# Altium schematic sheet Henishbhai.SchDoc
size OrCAD D
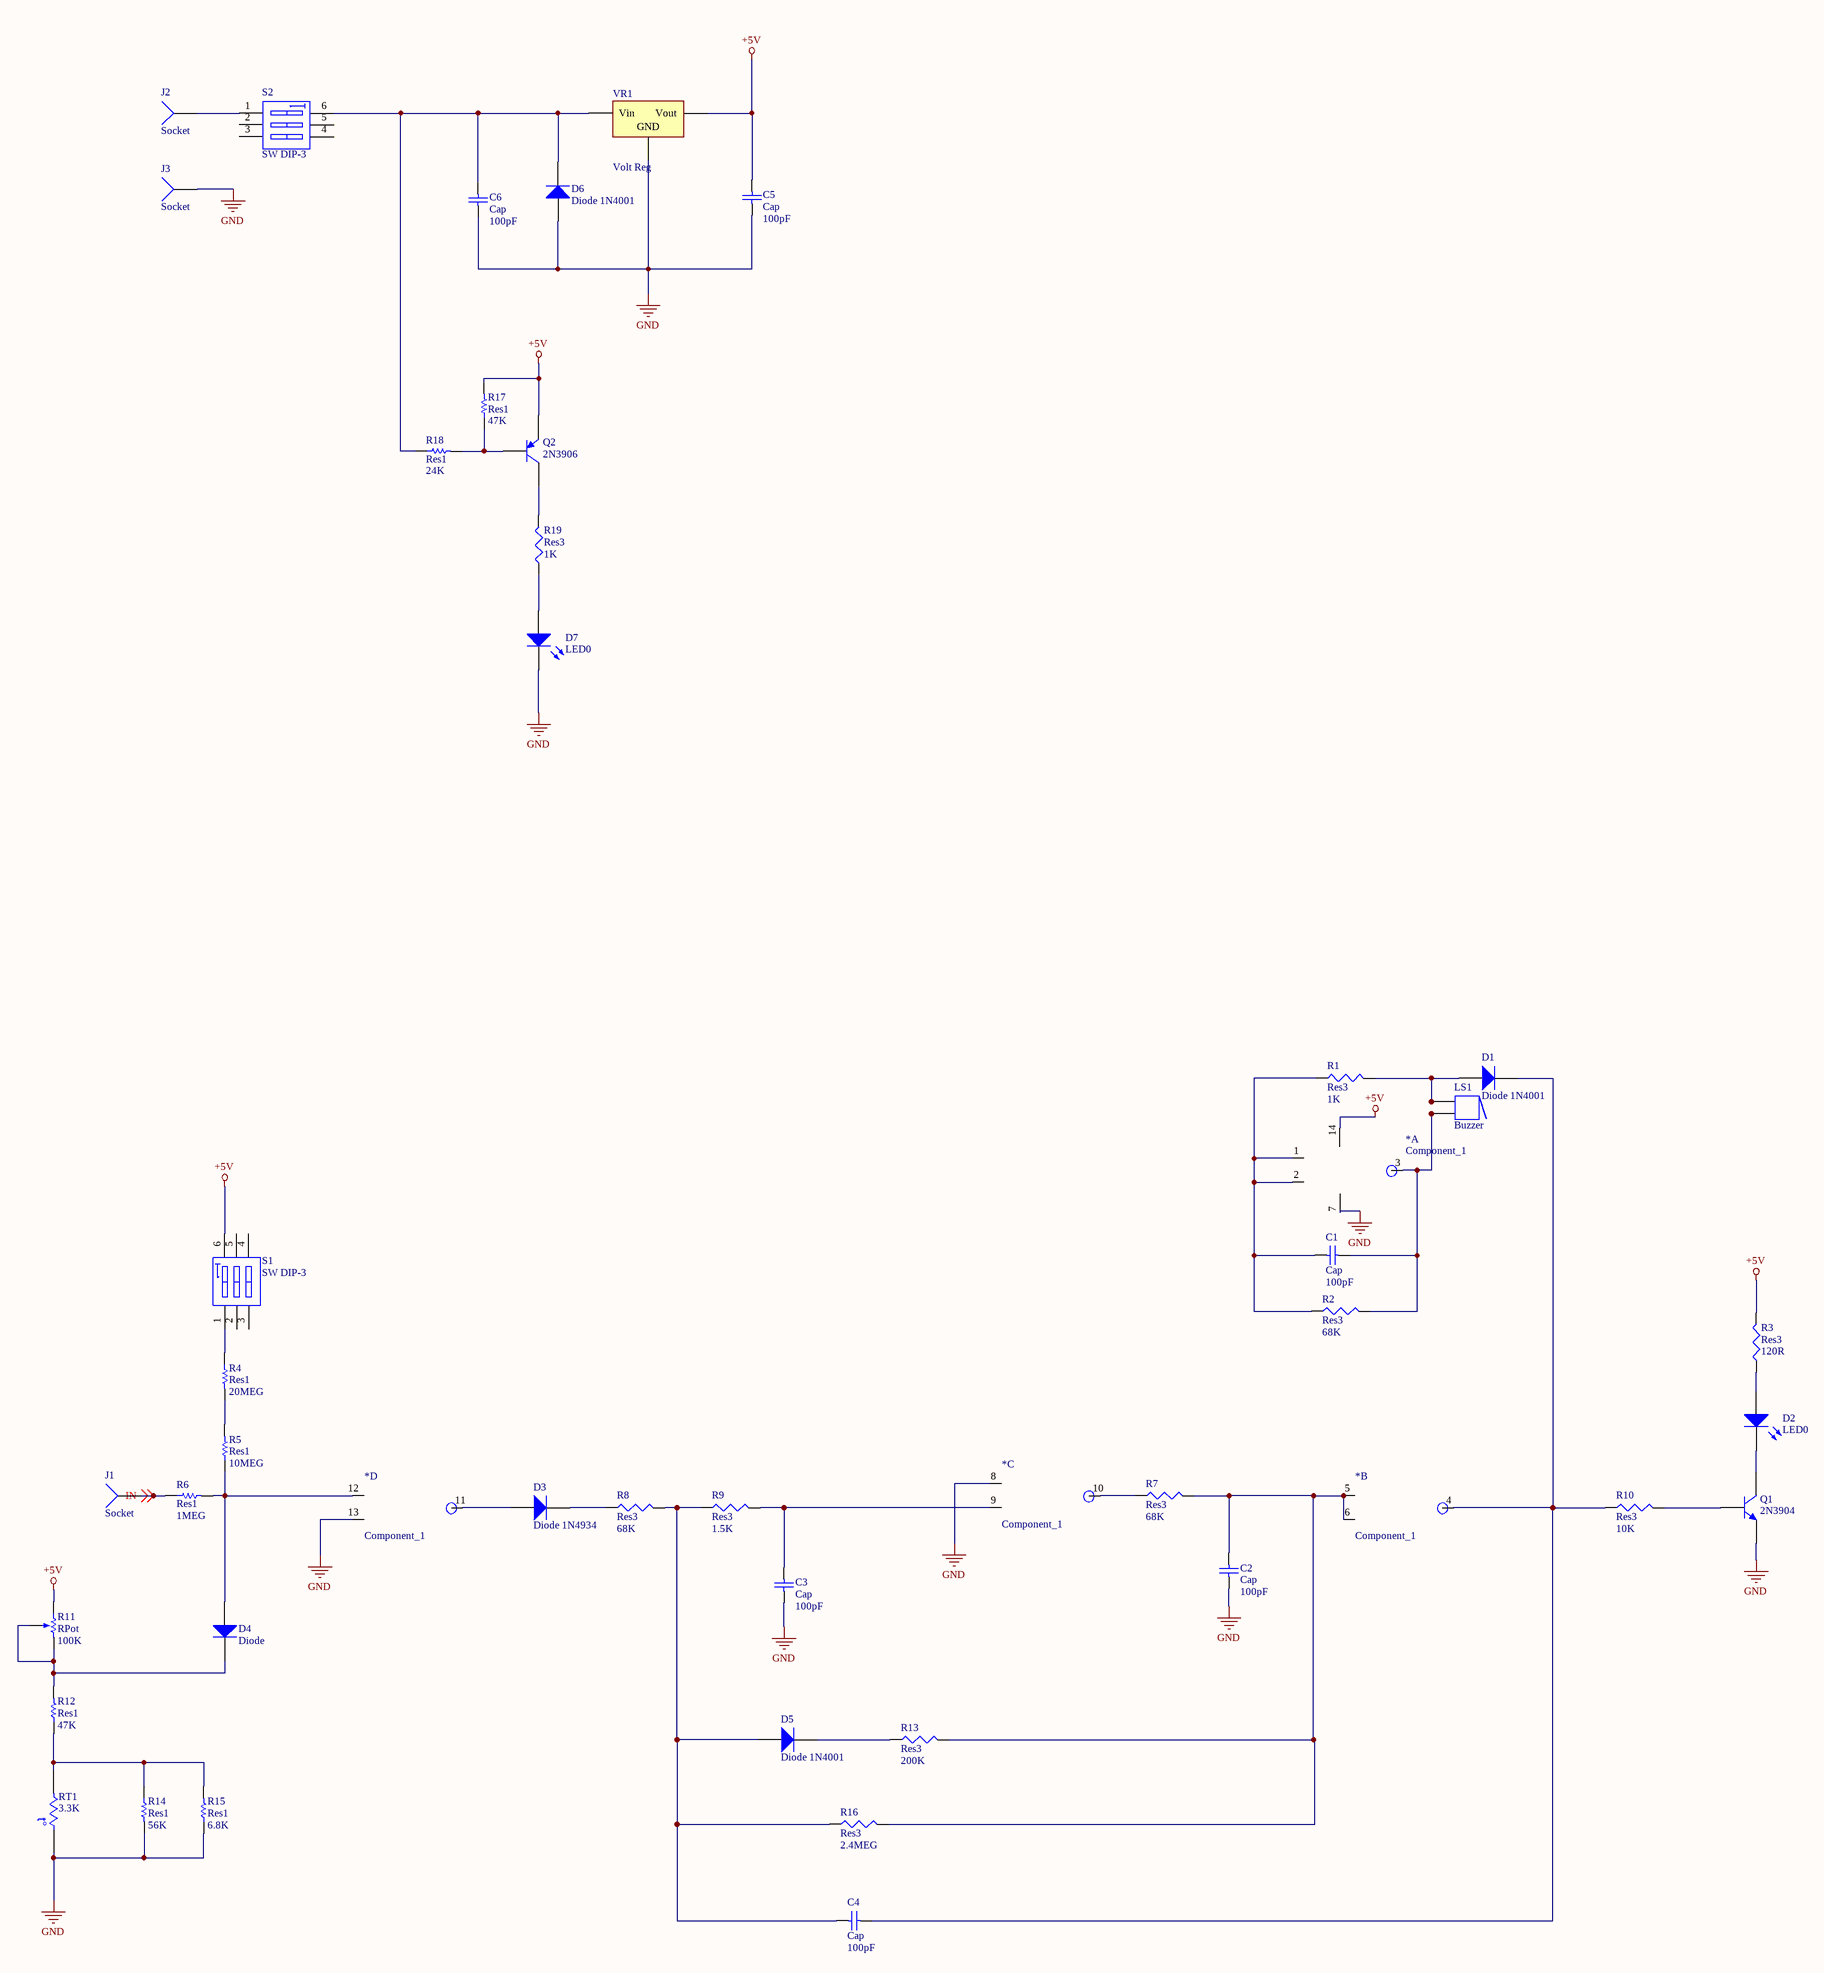
[diagram p0: Henishbhai.SchDoc]

## Parts
(Parts that share a designator on the sheet are numbered #1, #2 ... from top to bottom, then left to right.)
*#1  Component_1  [DIP-14]  (part A of 4)
*#2  Component_1  [DIP-14]  (part C of 4)
*#3  Component_1  [DIP-14]  (part D of 4)
*#4  Component_1  [DIP-14]  (part B of 4)
C1  Cap  value 100pF  [RAD-0.3]
C2  Cap  value 100pF  [RAD-0.3]
C3  Cap  value 100pF  [RAD-0.3]
C4  Cap  value 100pF  [RAD-0.3]
C5  Cap  value 100pF  [RAD-0.3]
C6  Cap  value 100pF  [RAD-0.3]
D1  Diode 1N4001  [DO-41]
D2  LED0  [PCBComponent_1]
D3  Diode 1N4934  [DO-41]
D4  Diode  [DO-41]
D5  Diode 1N4001  [DO-41]
D6  Diode 1N4001  [DO-41]
D7  LED0  [PCBComponent_1]
J1  Socket  [PIN1]
J2  Socket  [PIN1]
J3  Socket  [PIN1]
LS1  Buzzer  [RAD-0.1]
Q1  2N3904  [TO-92A]
Q2  2N3906  [TO-92A]
R1  Res3  value 1K  [AXIAL-0.4]
R2  Res3  value 68K  [AXIAL-0.4]
R3  Res3  value 120R  [AXIAL-0.4]
R4  Res1  value 20MEG  [AXIAL-0.4]
R5  Res1  value 10MEG  [AXIAL-0.4]
R6  Res1  value 1MEG  [AXIAL-0.4]
R7  Res3  value 68K  [AXIAL-0.4]
R8  Res3  value 68K  [AXIAL-0.4]
R9  Res3  value 1.5K  [AXIAL-0.4]
R10  Res3  value 10K  [AXIAL-0.4]
R11  RPot  value 100K  [VR5]
R12  Res1  value 47K  [AXIAL-0.4]
R13  Res3  value 200K  [AXIAL-0.4]
R14  Res1  value 56K  [AXIAL-0.4]
R15  Res1  value 6.8K  [AXIAL-0.4]
R16  Res3  value 2.4MEG  [AXIAL-0.4]
R17  Res1  value 47K  [AXIAL-0.4]
R18  Res1  value 24K  [AXIAL-0.4]
R19  Res3  value 1K  [AXIAL-0.4]
RT1  3.3K  [AXIAL-0.4]
S1  SW DIP-3  [DIP-6]
S2  SW DIP-3  [DIP-6]
VR1  Volt Reg  [VR5]

## Nets
+5V: *#1.14 C5.2 Q2.1(E) R3.2 R11.1(TOP) R17.2 S1.6(B1) VR1.3(Vout)
GND: *#1.7 *#2.8 *#3.13 C2.1 C3.1 C5.1 C6.1 D6.1(A) D7.2(K) J3.1 Q1.1(E) R14.2 R15.1 RT1.1 VR1.2(GND)
IN: J1.1 R6.1 ; off-sheet IN
Net*#1_1: *#1.1 *#1.2 C1.1 R1.1 R2.1
Net*#1_3: *#1.3 C1.2 LS1.2 LS1.2A R2.2
Net*#2_9: *#2.9 C3.2 R9.2
Net*#2_10: *#2.10 R7.1
Net*#3_11: *#3.11 D3.1(A)
Net*#3_12: *#3.12 D4.1(A) R5.1 R6.2
Net*#4_4: *#4.4 C4.2 D1.2(K) R10.1
Net*#4_5: *#4.5 *#4.6 C2.2 R7.2 R13.2 R16.2
NetC4_1: C4.1 D5.1(A) R8.2 R9.1 R16.1
NetC6_2: C6.2 D6.2(K) R18.1 S2.6(B1) VR1.1(Vin)
NetD1_1: D1.1(A) LS1.1 LS1.1A R1.2
NetD2_1: D2.1(A) R3.1
NetD2_2: D2.2(K) Q1.3(C)
NetD3_2: D3.2(K) R8.1
NetD4_2: D4.2(K) R11.2(BOT) R11.3(TAP) R12.2
NetD5_2: D5.2(K) R13.1
NetD7_1: D7.1(A) R19.1
NetJ2_1: J2.1 S2.1(A1)
NetQ1_2: Q1.2(B) R10.2
NetQ2_2: Q2.2(B) R17.1 R18.2
NetQ2_3: Q2.3(C) R19.2
NetR4_1: R4.1 S1.1(A1)
NetR4_2: R4.2 R5.2
NetR12_1: R12.1 R14.1 R15.2 RT1.2

Not connected (* = marked no-connect by the designer): S1 2(A2) 3(A3) 4(B3) 5(B2); S2 2(A2) 3(A3) 4(B3) 5(B2)

## Notes on the sheet
- Title
- Size:
- Date:
- File:
- Orcad D
- Number:
- Time:
- Revision:
- Sheet
- of
- (in symbol Res Thermal) t°

## Library data of the parts
C1-C6 = Cap: Capacitor; Published: 8-Jun-2000; LatestRevisionDate: 17-Jul-2002; LatestRevisionNote: Re-released for DXP Platform.; PackageReference: RAD-0.3; Publisher: Altium Limited; PackageDescription: Radial Cap, Thru-Hole; 2 Leads; 0.3 in Pin Spacing
D1 D5 D6 = Diode 1N4001: 1 Amp General Purpose Rectifier; Published: 8-Jun-2000; LatestRevisionDate: 17-Jul-2002; LatestRevisionNote: Re-released for DXP Platform.; DatasheetVersion: 1998; PackageVersion: Aug-1999; PackageReference: DO-41; Publisher: Altium Limited; PackageDescription: Diode, Axial; Body 5.2 x 2.7 mm (LxDia. max), Lead Dia. 0.86 mm (max); Code_JEDEC: DO-204-AL; ComponentLink1Description: Manufacturer Link; ComponentLink1URL: http://www.fairchildsemi.com/; ComponentLink2Description: Datasheet; ComponentLink2URL: http://www.fairchildsemi.com/ds/1N%2F1N4001.pdf
D2 D7 = LED0: Typical INFRARED GaAs LED; Published: 8-Jun-2000; LatestRevisionDate: 08-Jul-2005; LatestRevisionNote: Mech Layer 1 removed.; PackageReference: LED-0; Publisher: Altium Limited; PackageDescription: LED; 2 Leads
D3 = Diode 1N4934: 1 Amp Fast Recovery Rectifier; Published: 8-Jun-2000; LatestRevisionDate: 17-Jul-2002; LatestRevisionNote: Re-released for DXP Platform.; DatasheetVersion: 1999; PackageVersion: Aug-1999; PackageReference: DO-41; Publisher: Altium Limited; PackageDescription: Diode, Axial; Body 5.2 x 2.7 mm (LxDia. max), Lead Dia. 0.86 mm (max); Code_JEDEC: DO-204-AL; ComponentLink1Description: Manufacturer Link; ComponentLink1URL: http://www.fairchildsemi.com/; ComponentLink2Description: Datasheet; ComponentLink2URL: http://www.fairchildsemi.com/ds/1N%2F1N4934.pdf
D4 = Diode: Default Diode; Published: 8-Jun-2000; LatestRevisionDate: 17-Jul-2002; LatestRevisionNote: Re-released for DXP Platform.; PackageVersion: Sep-1996; PackageReference: SMC; Publisher: Altium Limited; PackageDescription: DO-214-AB/SMC; 2 C-Bend Leads; Body 7.9 x 5.9 mm, inc. leads (LxW); Code_JEDEC: DO-214-AB
LS1 = Buzzer: Magnetic Transducer Buzzer; Published: 24-Mar-1999; LatestRevisionDate: 17-Dec-2003; LatestRevisionNote: Schematic revised, PCB Footprint replaced.; DatasheetVersion: 17-Dec-2003; PackageReference: ABSM-1574; Publisher: Altium Limited; PackageDescription: Magnetic Transducer Buzzer; ComponentLink1Description: Manufacturer Link; ComponentLink1URL: http://www.megastar.com/linecard/buzzmode/index.php
Q1 = 2N3904: NPN General Purpose Amplifier; Published: 8-Jun-2000; LatestRevisionDate: 15-Jan-2003; LatestRevisionNote: PCB Footprint 'BCY-W3/D4.7' replaced; DatasheetVersion: 1997; PackageVersion: Sep-1998; PackageReference: TO-92A; Publisher: Altium Limited; PackageDescription: TO, Flat Index; 3 In-Line, Axial Leads; Body Dia. 4.5mm; Leads 0.51 x 0.48 mm (max); ComponentLink1Description: Manufacturer Link; ComponentLink1URL: http://www.fairchildsemi.com/; ComponentLink2Description: Datasheet; ComponentLink2URL: http://www.fairchildsemi.com/ds/2N%2F2N3904.pdf
Q2 = 2N3906: PNP General Purpose Amplifier; Published: 8-Jun-2000; LatestRevisionDate: 15-Jan-2003; LatestRevisionNote: PCB Footprint 'BCY-W3/D4.7' replaced; DatasheetVersion: 1997; PackageVersion: Sep-1998; PackageReference: TO-92A; Publisher: Altium Limited; PackageDescription: TO, Flat Index; 3 In-Line, Axial Leads; Body Dia. 4.5mm; Leads 0.51 x 0.48 mm (max); ComponentLink1Description: Manufacturer Link; ComponentLink1URL: http://www.fairchildsemi.com/; ComponentLink2Description: Datasheet; ComponentLink2URL: http://www.fairchildsemi.com/ds/2N%2F2N3906.pdf
R1-R3 R7-R10 R13 R16 R19 = Res3: Resistor; Published: 8-Jun-2000; LatestRevisionDate: 29-May-2009; LatestRevisionNote: IPC-7351 Footprint Added.; PackageReference: J1-0603; Publisher: Altium Limited; PackageDescription: Chip Resistor
R4-R6 R12 R14 R15 R17 R18 = Res1: Resistor; Published: 8-Jun-2000; LatestRevisionDate: 17-Jul-2002; LatestRevisionNote: Re-released for DXP Platform.; PackageReference: AXIAL-0.3; Publisher: Altium Limited; PackageDescription: Axial Device, Thru-Hole; 2 Leads; 0.3 in Pin Spacing
R11 = RPot: Potentiometer; Sim Note: Enter the Resistance value and the set point into parameter fields.; Set Position: 0.5; Published: 8-Jun-2000; LatestRevisionDate: 17-Jul-2002; LatestRevisionNote: Re-released for DXP Platform.; PackageReference: VR5; Publisher: Altium Limited; PackageDescription: Variable Resistor, Thru-Hole; 3 Leads
RT1 = Res Thermal: Thermistor; Published: 24-Mar-1999; LatestRevisionDate: 29-May-2009; LatestRevisionNote: IPC-7351 Footprint Added.; PackageVersion: Mar-2003; PackageReference: 6-0805; Publisher: Altium Limited; PackageDescription: Chip Resistor 0805 Case Size; Code_IPC: RESC2012
S1 S2 = SW DIP-3: DIP Switch, 3 Position, SPST; Published: 24-Mar-1999; LatestRevisionDate: 17-Jul-2002; LatestRevisionNote: Re-released for DXP Platform.; PackageReference: DIP-6; Publisher: Altium Limited; Code_JEDEC: MO-001-AM
VR1 = Volt Reg: Voltage Regulator; Published: 24-Mar-1999; LatestRevisionDate: 29-May-2009; LatestRevisionNote: IPC-7351 Footprint Added.; PackageReference: D2PAK; Publisher: Altium Limited; PackageDescription: 3-Pin Transistor Outline Package 2.54 mm Pitch, 15.1 mm Lead Span
J1-J3 = Socket: LatestRevisionDate: 17-Jul-2002; LatestRevisionNote: Re-released for DXP Platform.; Publisher: Altium Limited